# Altium schematic sheet Sunboost.SchDoc
size A3; Organization: Altium Limited; Address1: L3, 12a Rodborough Rd; Address2: Frenchs Forest; Address3: NSW; Address4: Australia 2086
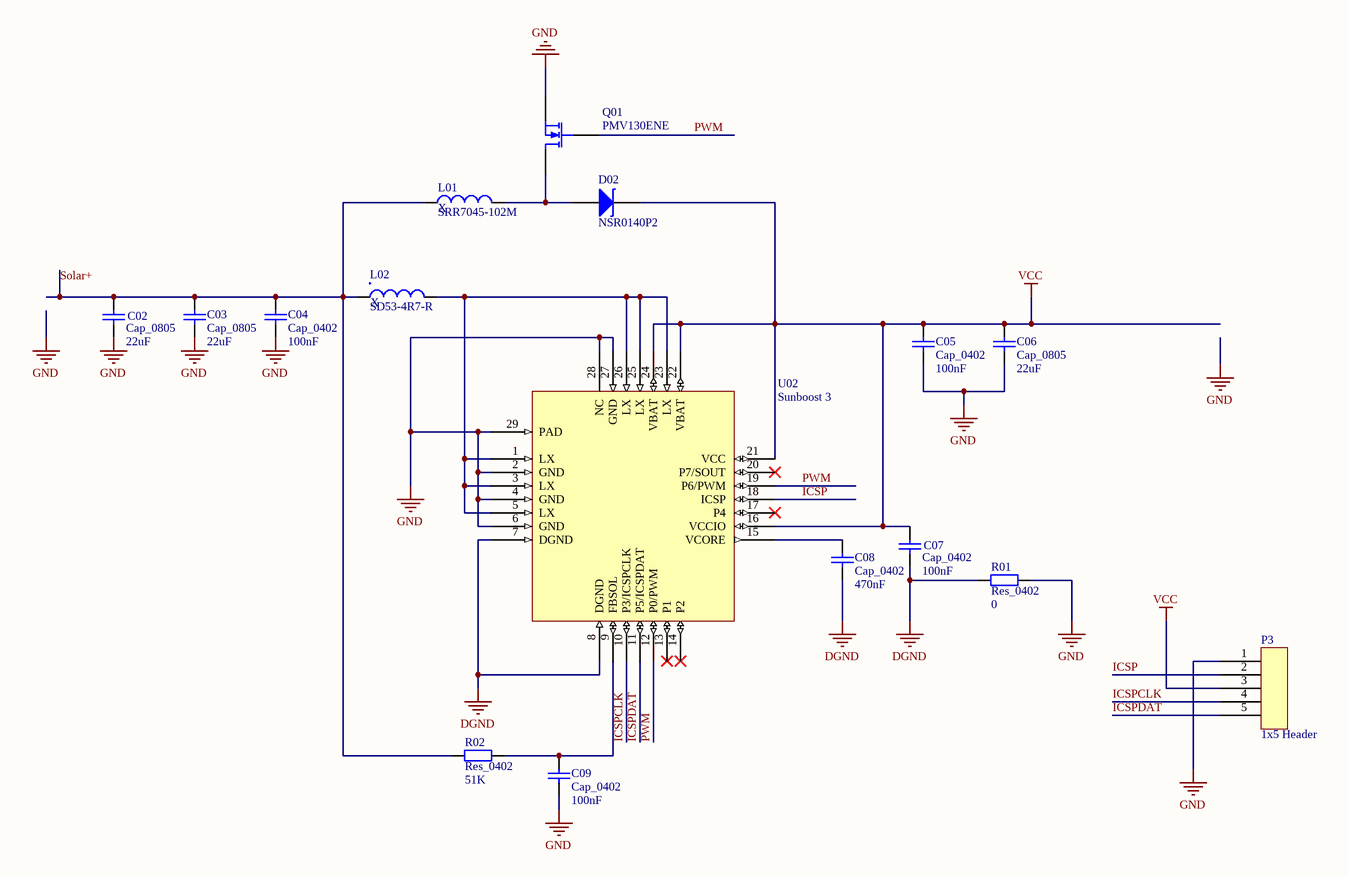
[diagram p0: Sunboost.SchDoc]

## Parts
C02  Cap_0805  value 22uF  [0805]
C03  Cap_0805  value 22uF  [0805]
C04  Cap_0402  value 100nF  [0402]
C05  Cap_0402  value 100nF  [0402]
C06  Cap_0805  value 22uF  [0805]
C07  Cap_0402  value 100nF  [0402]
C08  Cap_0402  value 470nF  [0402]
C09  Cap_0402  value 100nF  [0402]
D02  NSR0140P2  [SOD-923]
L01  SRR7045-102M  value X  [SRR7045-102M]
L02  SD53-4R7-R  value X  [SD53-4R7-R]
P3  1x5 Header  [1x5 Header 1.27]
Q01  PMV130ENE  [SOT-23]
R01  Res_0402  value 0  [0402]
R02  Res_0402  value 51K  [0402]
U02  Sunboost 3  [28-QFN_0.4mm]

## Nets
DGND: C07.1 C08.1 R01.1 U02.7(DGND) U02.8(DGND)
GND: C02.1 C03.1 C04.1 C05.1 C06.1 C09.1 P3.1 Q01.2(S) R01.2 U02.2(GND) U02.4(GND) U02.6(GND) U02.27(GND) U02.28(NC) U02.29(PAD)
VCC: C05.2 C06.2 C07.2 D02.1(K) P3.3 U02.16(VCCIO) U02.21(VCC) U02.22(VBAT) U02.24(VBAT)
ICSP: P3.2 U02.18(ICSP)
ICSPCLK: P3.4 U02.10(P3/ICSPCLK)
ICSPDAT: P3.5 U02.11(P5/ICSPDAT)
PWM: Q01.1(G) U02.12(P0/PWM) U02.19(P6/PWM)
Solar+: C02.2 C03.2 C04.2 L01.1 L02.1 R02.1
NetC08_2: C08.2 U02.15(VCORE)
NetC09_2: C09.2 R02.2 U02.9(FBSOL)
NetD02_2: D02.2(A) L01.2 Q01.3(D)
NetL02_2: L02.2 U02.1(LX) U02.3(LX) U02.5(LX) U02.23(LX) U02.25(LX) U02.26(LX)

Not connected (* = marked no-connect by the designer): U02 13(P1)* 14(P2)* 17(P4)* 20(P7/SOUT)*

## Notes on the sheet
- Title
- Size:
- Date:
- A3
- Number:
- Time:
- Revision:
- Sheet
- of
- File:

## Library data of the parts
C02 C03 C06 = Cap_0805: Capacitor; Published: 8-Jun-2000; LatestRevisionDate: 17-Jul-2002; LatestRevisionNote: Re-released for DXP Platform.; PackageReference: RAD-0.3; Publisher: Altium Limited; PackageDescription: Radial Cap, Thru-Hole; 2 Leads; 0.3 in Pin Spacing
C04 C05 C07 C08 C09 = Cap_0402: Capacitor; Published: 8-Jun-2000; LatestRevisionDate: 17-Jul-2002; LatestRevisionNote: Re-released for DXP Platform.; PackageReference: RAD-0.3; Publisher: Altium Limited; PackageDescription: Radial Cap, Thru-Hole; 2 Leads; 0.3 in Pin Spacing
D02 = NSR0140P2: Typical INFRARED GaAs LED; Published: 8-Jun-2000; LatestRevisionDate: 08-Jul-2005; LatestRevisionNote: Mech Layer 1 removed.; PackageReference: LED-0; Publisher: Altium Limited; PackageDescription: LED; 2 Leads
L01 = SRR7045-102M: Inductor
L02 = SD53-4R7-R: Inductor
Q01 = PMV130ENE: N-Channel MOSFET; Published: 8-Jun-2000; LatestRevisionDate: 17-Jul-2002; LatestRevisionNote: Re-released for DXP Platform.; PackageVersion: 1995/1996; PackageReference: E3; Publisher: Altium Limited; PackageDescription: TO, Flat Index; 3 In-Line, Axial Leads; Body Dia. 4.6mm; Lead Dia. 0.5 mm (max)
R01 R02 = Res_0402: Resistor; Published: 8-Jun-2000; LatestRevisionDate: 17-Jul-2002; LatestRevisionNote: Re-released for DXP Platform.; PackageReference: AXIAL-0.4; Publisher: Altium Limited; PackageDescription: Axial Device, Thru-Hole; 2 Leads; 0.4 in Pin Spacing
U02 = Sunboost 3: Initvation Sunboost 3